# Altium project Drug Delivery CON_V113.PrjPcb
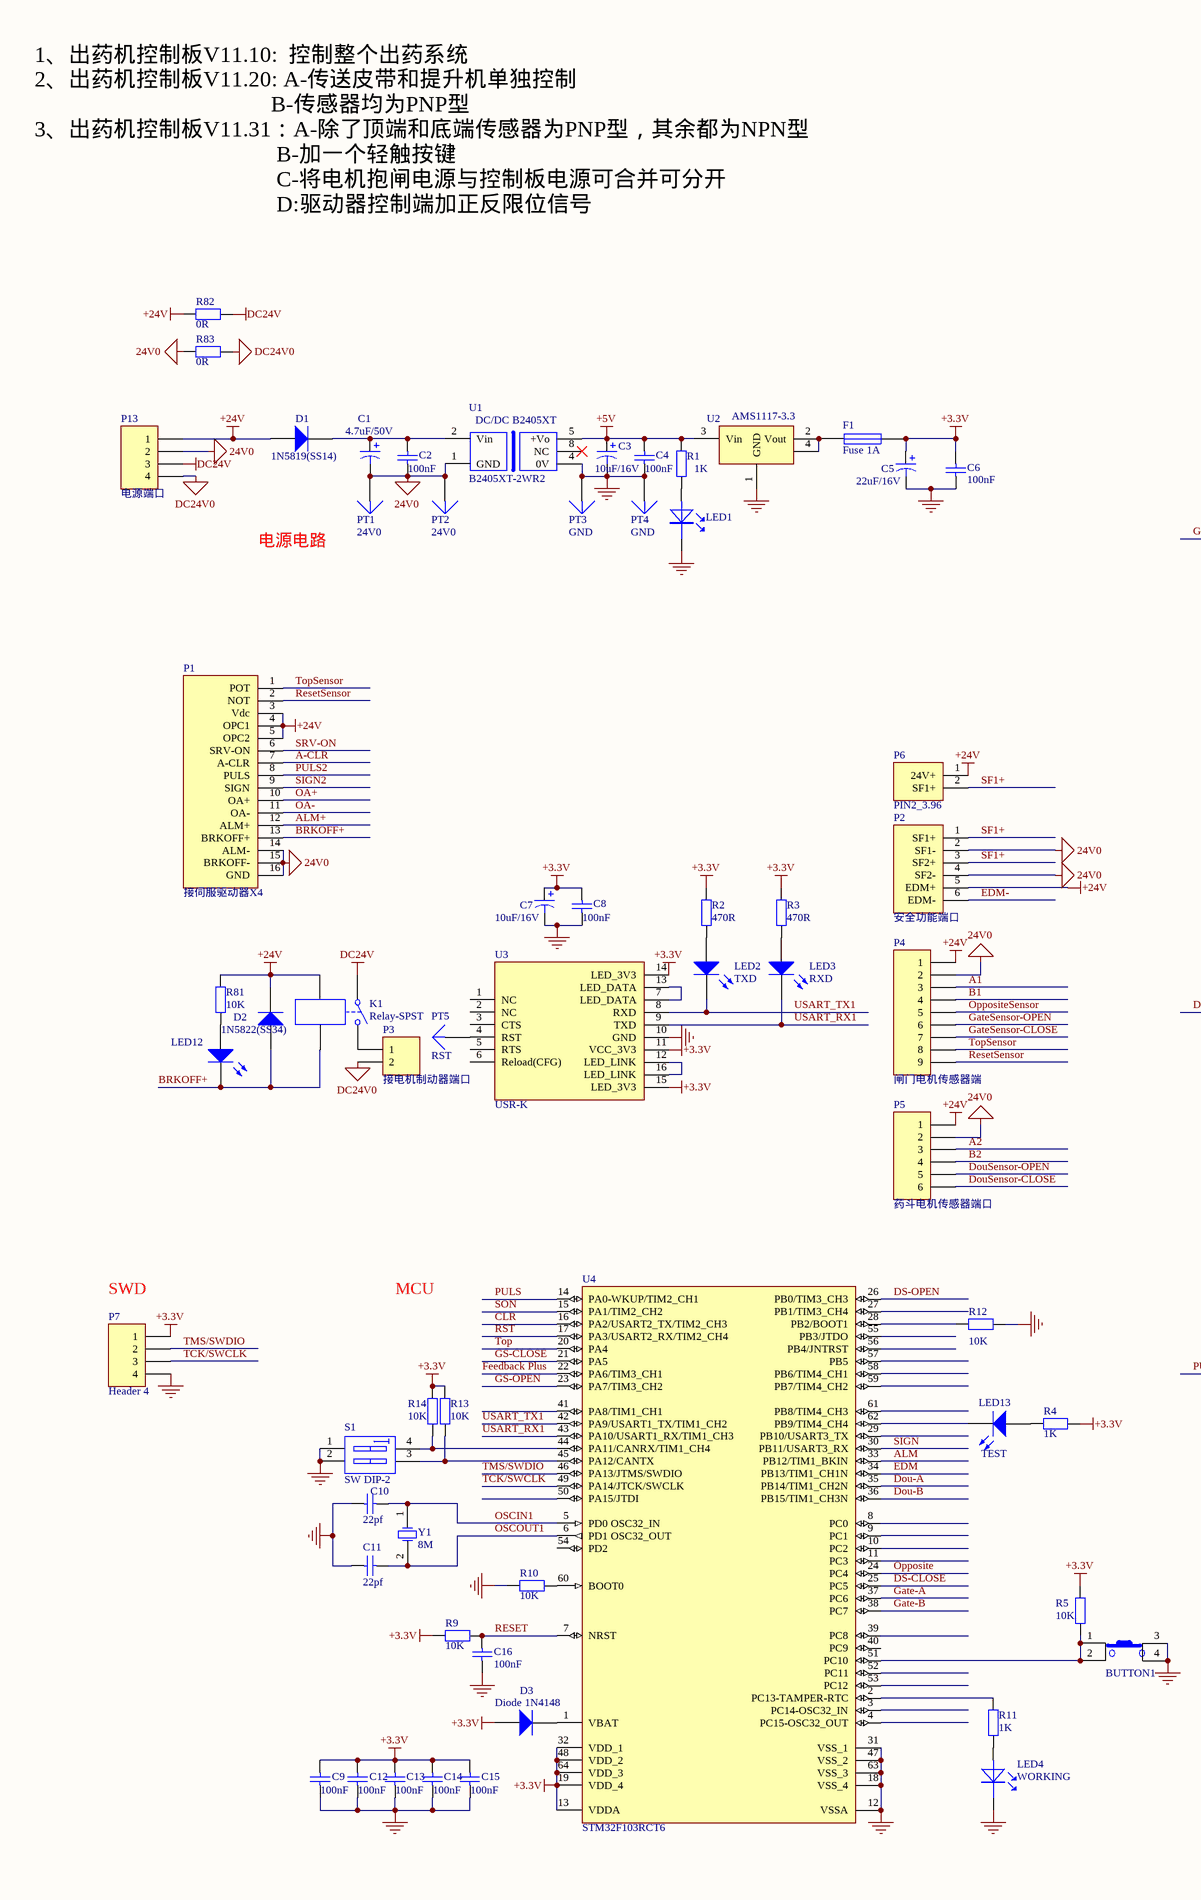
[diagram p0: Drug Delivery CON_V113.SchDoc, left]
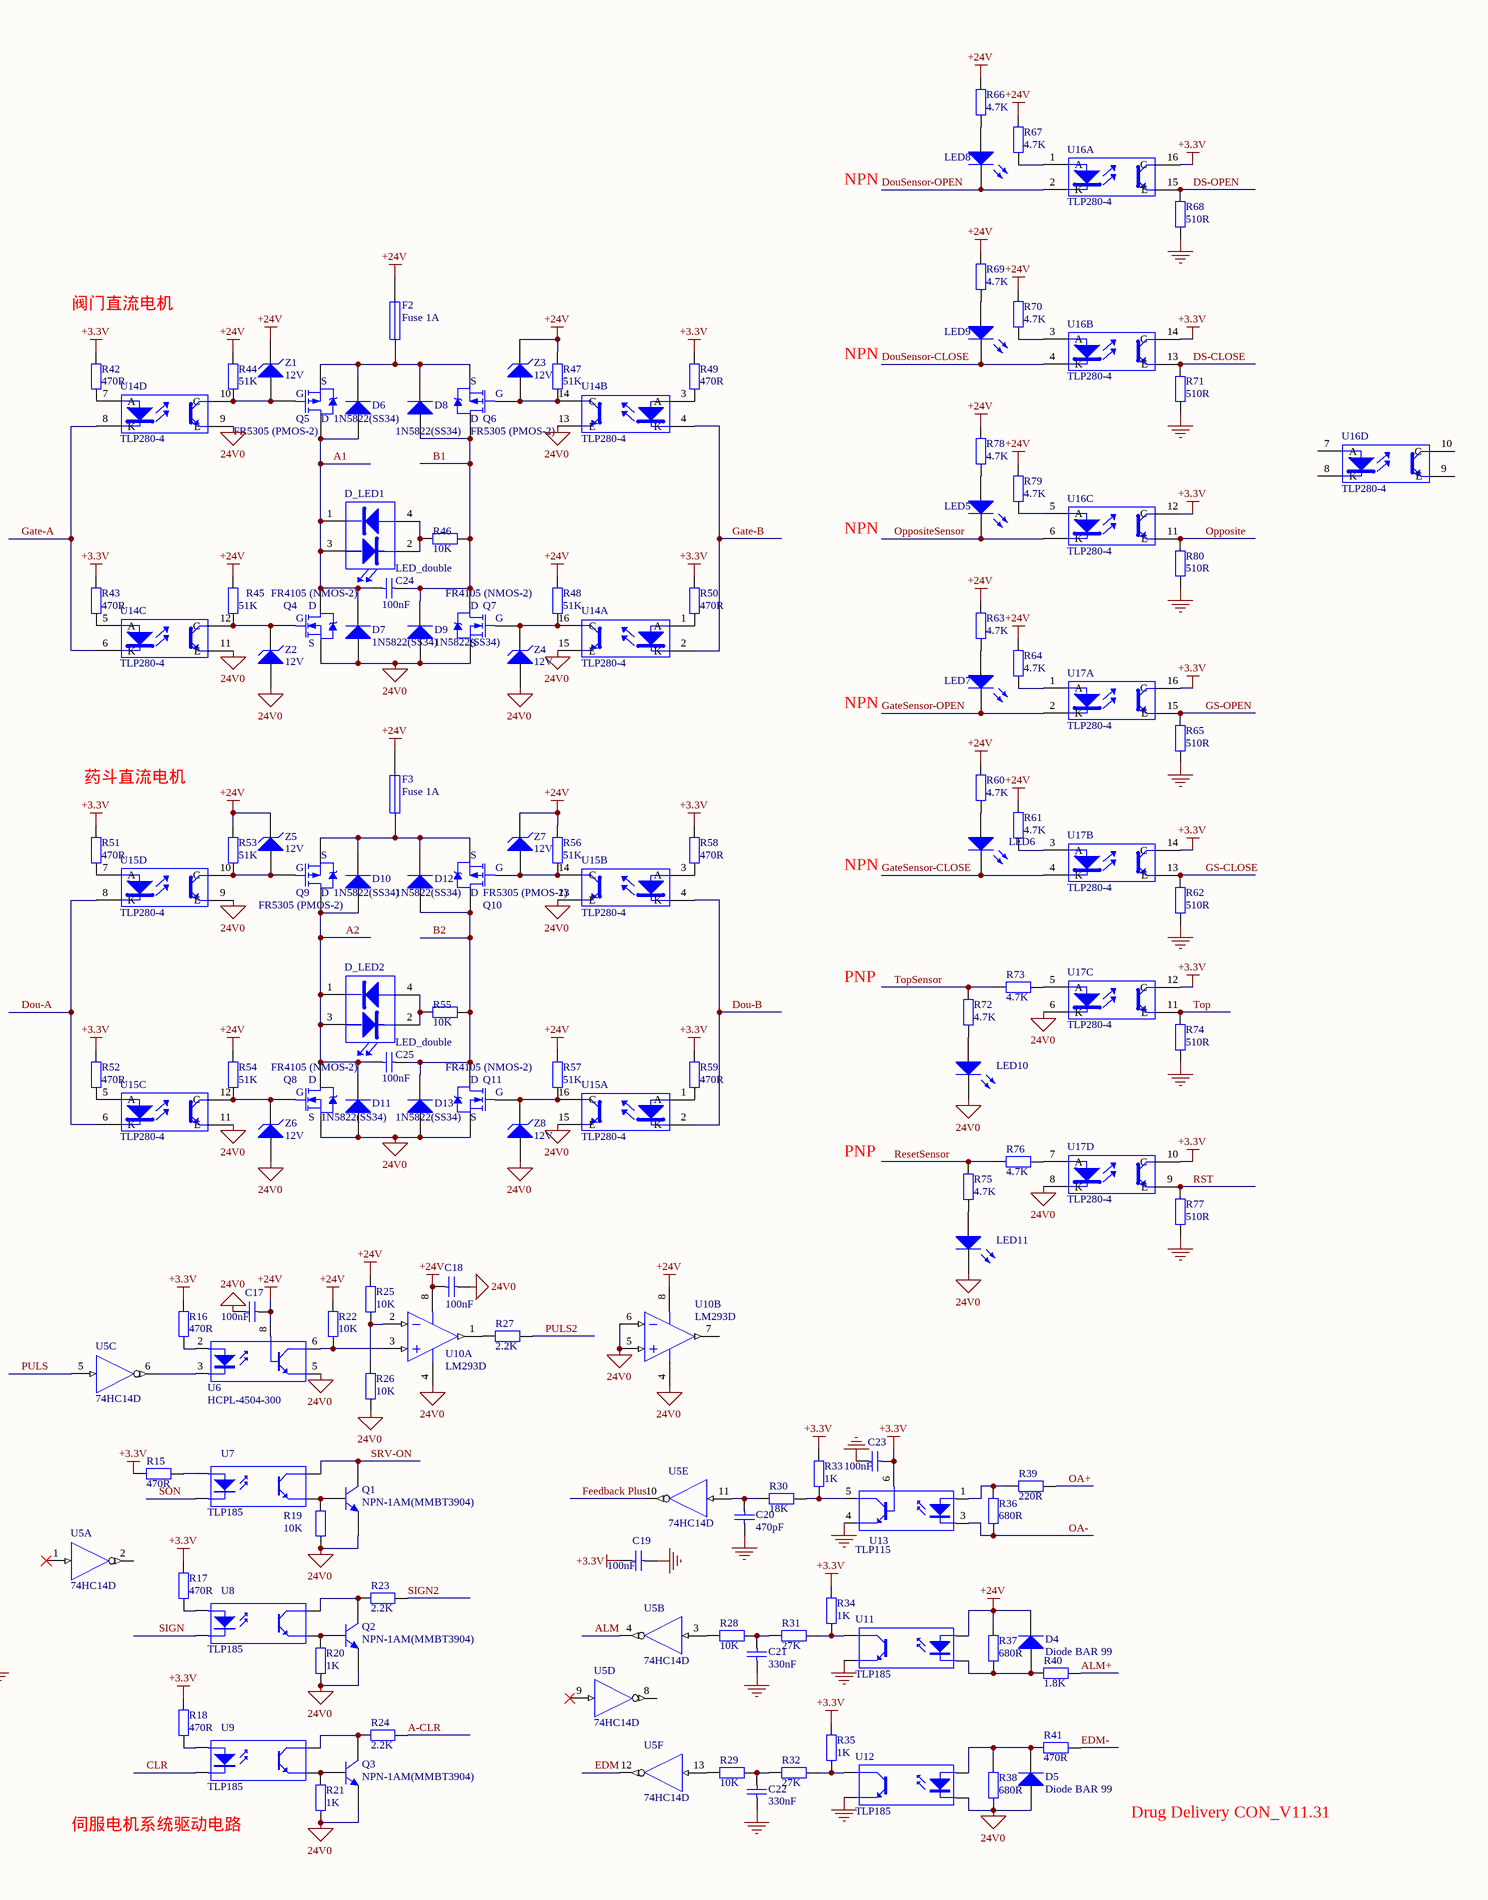
[diagram p1: Drug Delivery CON_V113.SchDoc, right]
1 sheet, 190 parts. Net scope: global (net labels, ports and power ports of the same name join across sheets).
Board file: Drug Delivery CON_V113.PcbDoc

## Sheet Drug Delivery CON_V113.SchDoc
size A2; PageSetup: Record=PageOptions|CenterHorizontal=True|CenterVertical=True|PrintScale=0.77|XCorrection=1.00|YCorrection=1.00|PrintKind=1|BorderSize=5000000|LeftOffset=0|BottomOffset=0|Orientation=2|PaperLength=1000|PaperWidth=1000|Scale=100|PaperSource=7|PrintQuality=-4|MediaType=1|DitherType=10|PaperKind=A3|PrintScaleMode=1

### Parts
(Parts that share a designator on the sheet are numbered #1, #2 ... from top to bottom, then left to right.)
BUTTON1  SW4  [BUTTON]  (value not drawn)
C1  value 4.7uF/50V  [CAP D-7343]  (hidden comment: Cap Pol3)
C2  value 100nF  [0805]  (hidden comment: Cap)
C3  value 10uF/16V  [CAP A-3216]  (hidden comment: Cap Pol3)
C4  value 100nF  [0805]  (hidden comment: Cap)
C5  value 22uF/16V  [CAP D-7343]  (hidden comment: Cap Pol3)
C6  value 100nF  [0805]  (hidden comment: Cap)
C7  value 10uF/16V  [CAP A-3216]  (hidden comment: Cap Pol3)
C8  value 100nF  [0805]  (hidden comment: Cap)
C9  value 100nF  [0805]  (hidden comment: Cap)
C10  value 22pf  [0805]
C11  value 22pf  [0805]
C12  value 100nF  [0805]  (hidden comment: Cap)
C13  value 100nF  [0805]  (hidden comment: Cap)
C14  value 100nF  [0805]  (hidden comment: Cap)
C15  value 100nF  [0805]  (hidden comment: Cap)
C16  value 100nF  [0805]  (hidden comment: Cap)
C17  value 100nF  [0805]  (hidden comment: Cap)
C18  value 100nF  [0805]  (hidden comment: Cap)
C19  value 100nF  [0805]  (hidden comment: Cap)
C20  value 470pF  [0805]  (hidden comment: Cap)
C21  value 330nF  [0805]  (hidden comment: Cap)
C22  value 330nF  [0805]  (hidden comment: Cap)
C23  value 100nF  [0805]  (hidden comment: Cap)
C24  value 100nF  [0805]  (hidden comment: Cap)
C25  value 100nF  [0805]  (hidden comment: Cap)
D1  1N5819(SS14)  [SMA]
D2  1N5822(SS34)  [SMA]
D3  Diode 1N4148  [LED-0805]
D4  Diode BAR 99  [SOT-23]
D5  Diode BAR 99  [SOT-23]
D6  1N5822(SS34)  [SMA]
D7  1N5822(SS34)  [SMA]
D8  1N5822(SS34)  [SMA]
D9  1N5822(SS34)  [SMA]
D10  1N5822(SS34)  [SMA]
D11  1N5822(SS34)  [SMA]
D12  1N5822(SS34)  [SMA]
D13  1N5822(SS34)  [SMA]
D_LED1  LED_double  [Double LED-0603]
D_LED2  LED_double  [Double LED-0603]
F1  Fuse 1A  [3225[1210]]
F2  Fuse 1A  [3225[1210]]
F3  Fuse 1A  [3225[1210]]
K1  Relay-SPST  [Delay_APA3312]
LED1  LED  [LED-0805]  (value not drawn)
LED2  TXD  [LED-0805]
LED3  RXD  [LED-0805]
LED4  WORKING  [LED-0805]
LED5  LED  [LED-0805]  (value not drawn)
LED6  LED  [LED-0805]  (value not drawn)
LED7  LED  [LED-0805]  (value not drawn)
LED8  LED  [LED-0805]  (value not drawn)
LED9  LED  [LED-0805]  (value not drawn)
LED10  LED  [LED-0805]  (value not drawn)
LED11  LED  [LED-0805]  (value not drawn)
LED12  LED  [LED-0805]  (value not drawn)
LED13  TEST  [LED-0805]
P1  接伺服驱动器X4  [VH3.96 16PIN]
P2  安全功能端口  [VH3.96  6PIN]
P3  接电机制动器端口  [VH3.96  2PIN]
P4  闸门电机传感器端  [VH3.96 9PIN]
P5  药斗电机传感器端口  [VH3.96  6PIN]
P6  PIN2_3.96  [VH3.96  2PIN]
P7  Header 4  [PIN4-1.27]
P13  电源端口  [VH3.96  4PIN]
PT1  24V0  [PLUG]
PT2  24V0  [PLUG]
PT3  GND  [PLUG]
PT4  GND  [PLUG]
PT5  RST  [PLUG]
Q1  NPN-1AM(MMBT3904)  [SOT-23B]
Q2  NPN-1AM(MMBT3904)  [SOT-23B]
Q3  NPN-1AM(MMBT3904)  [SOT-23B]
Q4  FR4105 (NMOS-2)  [TO-252]
Q5  FR5305 (PMOS-2)  [TO-252]
Q6  FR5305 (PMOS-2)  [TO-252]
Q7  FR4105 (NMOS-2)  [TO-252]
Q8  FR4105 (NMOS-2)  [TO-252]
Q9  FR5305 (PMOS-2)  [TO-252]
Q10  FR5305 (PMOS-2)  [TO-252]
Q11  FR4105 (NMOS-2)  [TO-252]
R1  value 1K  [0805]  (hidden comment: Res2)
R2  value 470R  [0805]  (hidden comment: Res2)
R3  value 470R  [0805]  (hidden comment: Res2)
R4  value 1K  [0805]  (hidden comment: Res2)
R5  value 10K  [0805]  (hidden comment: Res2)
R9  value 10K  [0805]  (hidden comment: Res2)
R10  value 10K  [0805]  (hidden comment: Res2)
R11  value 1K  [0805]  (hidden comment: Res2)
R12  value 10K  [0805]  (hidden comment: Res2)
R13  value 10K  [0805]  (hidden comment: Res2)
R14  value 10K  [0805]  (hidden comment: Res2)
R15  value 470R  [0805]  (hidden comment: Res2)
R16  value 470R  [0805]  (hidden comment: Res2)
R17  value 470R  [0805]  (hidden comment: Res2)
R18  value 470R  [0805]  (hidden comment: Res2)
R19  value 10K  [0805]  (hidden comment: Res2)
R20  value 1K  [0805]  (hidden comment: Res2)
R21  value 1K  [0805]  (hidden comment: Res2)
R22  value 10K  [0805]  (hidden comment: Res2)
R23  value 2.2K  [0805]  (hidden comment: Res2)
R24  value 2.2K  [0805]  (hidden comment: Res2)
R25  value 10K  [0805]  (hidden comment: Res2)
R26  value 10K  [0805]  (hidden comment: Res2)
R27  value 2.2K  [0805]  (hidden comment: Res2)
R28  value 10K  [0805]  (hidden comment: Res2)
R29  value 10K  [0805]  (hidden comment: Res2)
R30  value 18K  [0805]  (hidden comment: Res2)
R31  value 27K  [0805]  (hidden comment: Res2)
R32  value 27K  [0805]  (hidden comment: Res2)
R33  value 1K  [0805]  (hidden comment: Res2)
R34  value 1K  [0805]  (hidden comment: Res2)
R35  value 1K  [0805]  (hidden comment: Res2)
R36  value 680R  [0805]  (hidden comment: Res2)
R37  value 680R  [0805]  (hidden comment: Res2)
R38  value 680R  [0805]  (hidden comment: Res2)
R39  value 220R  [0805]  (hidden comment: Res2)
R40  value 1.8K  [0805]  (hidden comment: Res2)
R41  value 470R  [0805]  (hidden comment: Res2)
R42  value 470R  [0805]  (hidden comment: Res2)
R43  value 470R  [0805]  (hidden comment: Res2)
R44  value 51K  [0805]  (hidden comment: Res2)
R45  value 51K  [0805]  (hidden comment: Res2)
R46  value 10K  [0805]  (hidden comment: Res2)
R47  value 51K  [0805]  (hidden comment: Res2)
R48  value 51K  [0805]  (hidden comment: Res2)
R49  value 470R  [0805]  (hidden comment: Res2)
R50  value 470R  [0805]  (hidden comment: Res2)
R51  value 470R  [0805]  (hidden comment: Res2)
R52  value 470R  [0805]  (hidden comment: Res2)
R53  value 51K  [0805]  (hidden comment: Res2)
R54  value 51K  [0805]  (hidden comment: Res2)
R55  value 10K  [0805]  (hidden comment: Res2)
R56  value 51K  [0805]  (hidden comment: Res2)
R57  value 51K  [0805]  (hidden comment: Res2)
R58  value 470R  [0805]  (hidden comment: Res2)
R59  value 470R  [0805]  (hidden comment: Res2)
R60  value 4.7K  [0805]  (hidden comment: Res2)
R61  value 4.7K  [0805]  (hidden comment: Res2)
R62  value 510R  [0805]  (hidden comment: Res2)
R63  value 4.7K  [0805]  (hidden comment: Res2)
R64  value 4.7K  [0805]  (hidden comment: Res2)
R65  value 510R  [0805]  (hidden comment: Res2)
R66  value 4.7K  [0805]  (hidden comment: Res2)
R67  value 4.7K  [0805]  (hidden comment: Res2)
R68  value 510R  [0805]  (hidden comment: Res2)
R69  value 4.7K  [0805]  (hidden comment: Res2)
R70  value 4.7K  [0805]  (hidden comment: Res2)
R71  value 510R  [0805]  (hidden comment: Res2)
R72  value 4.7K  [0805]  (hidden comment: Res2)
R73  value 4.7K  [0805]  (hidden comment: Res2)
R74  value 510R  [0805]  (hidden comment: Res2)
R75  value 4.7K  [0805]  (hidden comment: Res2)
R76  value 4.7K  [0805]  (hidden comment: Res2)
R77  value 510R  [0805]  (hidden comment: Res2)
R78  value 4.7K  [0805]  (hidden comment: Res2)
R79  value 4.7K  [0805]  (hidden comment: Res2)
R80  value 510R  [0805]  (hidden comment: Res2)
R81  value 10K  [0805]  (hidden comment: Res2)
R82  value 0R  [0805]  (hidden comment: Res2)
R83  value 0R  [0805]  (hidden comment: Res2)
S1  SW DIP-2  [SW2  4DIP]
U1  B2405XT-2WR2  [B2405XT-2WR2]
U2  AMS1117-3.3  [SOT223]
U3  USR-K  [USR-K]
U4  STM32F103RCT6  [LQFP64_M]
U5#1  74HC14D  [SO14]  (parts A,B,C,D,E of 6)
U5#2  74HC14D  [SO14]  (part F of 6)
U6  HCPL-4504-300  [SO8(7.62)]
U7  TLP185  [SOP4]
U8  TLP185  [SOP4]
U9  TLP185  [SOP4]
U10  LM293D  [SOP8]  (parts A,B of 2)
U11  TLP185  [SOP4]
U12  TLP185  [SOP4]
U13  TLP115  [SOP5(6)]
U14  TLP280-4  [SOP16]  (parts A,B,C,D of 4)
U15  TLP280-4  [SOP16]  (parts A,B,C,D of 4)
U16  TLP280-4  [SOP16]  (parts A,B,C,D of 4)
U17  TLP280-4  [SOP16]  (parts A,B,C,D of 4)
Y1  8M  [XTAL]
Z1  12V  [SMA]
Z2  12V  [SMA]
Z3  12V  [SMA]
Z4  12V  [SMA]
Z5  12V  [SMA]
Z6  12V  [SMA]
Z7  12V  [SMA]
Z8  12V  [SMA]

### Nets
24V0: C1.2 C2.2 C17.2 C18.1 D5.3(A) D7.1(A) D9.1(A) D11.1(A) D13.1(A) LED10.2(K) LED11.2(K) P1.14(ALM-) P1.15(BRKOFF-) P1.16(GND) P2.2(SF1-) P2.4(SF2-) P4.2 P5.2 P13.2 PT1.1 PT2.1 Q1.2(E) Q2.2(E) Q3.2(E) Q4.3(S) Q7.3(S) Q8.3(S) Q11.3(S) R19.1 R20.2 R21.2 R26.1 R38.2 R83.1 U1.1(GND) U6.5(E) U10.4(GND) U10.5(IN+) U10.6(IN-) U12.2(K) U14.9(E) U14.11(E) U14.13(E) U14.15(E) U15.9(E) U15.11(E) U15.13(E) U15.15(E) U17.6(K) U17.8(K) Z2.1(A) Z4.1(A) Z6.1(A) Z8.1(A)
+3.3V: C5.1 C6.2 C7.1 C8.2 C9.2 C12.2 C13.2 C14.2 C15.2 C19.2 C23.1 D3.1(A) F1.2 P7.1 R2.2 R3.2 R4.1 R5.1 R9.1 R13.1 R14.1 R15.2 R16.1 R17.1 R18.1 R33.1 R34.1 R35.1 R42.1 R43.1 R49.2 R50.2 R51.1 R52.2 R58.1 R59.2 U3.11(VCC_3V3) U3.14(LED_3V3) U3.15(LED_3V3) U4.13(VDDA) U4.19(VDD_4) U4.32(VDD_1) U4.48(VDD_2) U4.64(VDD_3) U5#1.14(VCC) U5#2.14(VCC) U13.6(B) U16.12(C) U16.14(C) U16.16(C) U17.10(C) U17.12(C) U17.14(C) U17.16(C)
+5V: C3.1 C4.2 R1.1 U1.5(+Vo) U2.3(Vin)
+24V: C17.1 C18.2 D1.1(A) D2.2(K) D4.1(K) F2.2 F3.2 K1.1 P1.3(Vdc) P1.4(OPC1) P1.5(OPC2) P2.5(EDM+) P4.1 P5.1 P6.1(24V+) P13.1 R22.1 R25.2 R37.1 R44.2 R45.2 R47.2 R48.2 R53.2 R54.2 R56.2 R57.2 R60.1 R61.1 R63.1 R64.1 R66.1 R67.1 R69.1 R70.1 R78.2 R79.1 R81.1 R82.1 U6.7 U6.8(B) U10.8(V+) U11.1(A) Z1.2(K) Z3.2(K) Z5.2(K) Z7.2(K)
DC24V: K1.3 P13.3 R82.2
DC24V0: P3.2 P13.4 R83.2
GND: BUTTON1.3 BUTTON1.4 C3.2 C4.1 C5.2 C6.1 C7.2 C8.1 C9.1 C10.1 C11.1 C12.1 C13.1 C14.1 C15.1 C16.1 C19.1 C20.2 C21.2 C22.2 C23.2 LED1.2 LED4.2 P7.4 PT3.1 PT4.1 R10.1 R12.1 R62.1 R65.1 R68.1 R71.1 R74.1 R77.1 R80.1 S1.1(A1) S1.2(A2) U1.4(0V) U2.1(GND) U3.10(GND) U4.12(VSSA) U4.18(VSS_4) U4.31(VSS_1) U4.47(VSS_2) U4.63(VSS_3) U5#1.7(GND) U5#2.7(GND) U11.3(E) U12.3(E) U13.4(E)
A1: C24.2 D6.1(A) D7.2(K) D_LED1.1 D_LED1.3 P4.3 Q4.2(D) Q5.2(D)
A2: C25.2 D10.1(A) D11.2(K) D_LED2.1 D_LED2.3 P5.3 Q8.2(D) Q9.2(D)
A-CLR: P1.7(A-CLR) R24.2
ALM: U4.33(PB12/TIM1_BKIN) U5#1.4(Y)
ALM+: P1.12(ALM+) R40.2
B1: C24.1 D8.1(A) D9.2(K) P4.4 Q6.2(D) Q7.2(D) R46.1
B2: C25.1 D12.1(A) D13.2(K) P5.4 Q10.2(D) Q11.2(D) R55.1
BRKOFF+: D2.1(A) K1.2 LED12.2(K) P1.13(BRKOFF+)
CLR: U4.16(PA2/USART2_TX/TIM2_CH3) U9.2(K)
Dou-A: U4.35(PB14/TIM1_CH2N) U15.6(K) U15.8(K)
Dou-B: U4.36(PB15/TIM1_CH3N) U15.2(K) U15.4(K)
DouSensor-CLOSE: LED9.2(K) P5.6 U16.4(K)
DouSensor-OPEN: LED8.2(K) P5.5 U16.2(K)
DS-CLOSE: R71.2 U4.25(PC5) U16.13(E)
DS-OPEN: R68.2 U4.26(PB0/TIM3_CH3) U16.15(E)
EDM: U4.34(PB13/TIM1_CH1N) U5#2.12(Y)
EDM-: P2.6(EDM-) R41.2
Feedback Plus: U4.22(PA6/TIM3_CH1) U5#1.10(Y)
Gate-A: U4.37(PC6) U14.6(K) U14.8(K)
Gate-B: U4.38(PC7) U14.2(K) U14.4(K)
GateSensor-CLOSE: LED6.2(K) P4.7 U17.4(K)
GateSensor-OPEN: LED7.2(K) P4.6 U17.2(K)
GS-CLOSE: R62.2 U4.21(PA5) U17.13(E)
GS-OPEN: R65.2 U4.23(PA7/TIM3_CH2) U17.15(E)
OA+: P1.10(OA+) R39.2
OA-: P1.11(OA-) R36.2 U13.3(K)
Opposite: R80.2 U4.24(PC4) U16.11(E)
OppositeSensor: LED5.2(K) P4.5 U16.6(K)
OSCIN1: C10.2 U4.5(PD0_OSC32_IN) Y1.1(OSC1)
OSCOUT1: C11.2 U4.6(PD1_OSC32_OUT) Y1.2(OSC2)
PULS: U4.14(PA0-WKUP/TIM2_CH1) U5#1.5(A)
PULS2: P1.8(PULS) R27.2
RESET: C16.2 R9.2 U4.7(NRST)
ResetSensor: P1.2(NOT) P4.9 R75.1 R76.2
RST: R77.2 U4.17(PA3/USART2_RX/TIM2_CH4) U17.9(E)
SF1+: P2.1(SF1+) P2.3(SF2+) P6.2(SF1+)
SIGN: U4.30(PB11/USART3_RX) U8.2(K)
SIGN2: P1.9(SIGN) R23.2
SON: U4.15(PA1/TIM2_CH2) U7.2(K)
SRV-ON: P1.6(SRV-ON) Q1.3(C) U7.4(C)
TCK/SWCLK: P7.3 U4.49(PA14/JTCK/SWCLK)
TMS/SWDIO: P7.2 U4.46(PA13/JTMS/SWDIO)
Top: R74.2 U4.20(PA4) U17.11(E)
TopSensor: P1.1(POT) P4.8 R72.1 R73.2
USART_RX1: LED3.2(K) U3.9(TXD) U4.43(PA10/USART1_RX/TIM1_CH3)
USART_TX1: LED2.2(K) U3.8(RXD) U4.42(PA9/USART1_TX/TIM1_CH2)
NetBUTTON1_1: BUTTON1.1 BUTTON1.2 R5.2 U4.51(PC10)
NetC1_1: C1.1 C2.1 D1.2(K) U1.2(Vin)
NetC20_1: C20.1 R30.1 U5#1.11(A)
NetC21_1: C21.1 R28.2 R31.1
NetC22_1: C22.1 R29.2 R32.1
NetD3_2: D3.2(K) U4.1(VBAT)
NetD4_3: D4.3(A) R37.2 R40.1 U11.2(K)
NetD5_1: D5.1(K) R38.1 R41.1 U12.1(A)
NetD6_2: D6.2(K) D8.2(K) F2.1 Q5.3(S) Q6.3(S)
NetD10_2: D10.2(K) D12.2(K) F3.1 Q9.3(S) Q10.3(S)
NetD_LED1_2: D_LED1.2 D_LED1.4 R46.2
NetD_LED2_2: D_LED2.2 D_LED2.4 R55.2
NetF1_1: F1.1 U2.2(Vout) U2.4
NetK1_4: K1.4 P3.1
NetLED1_1: LED1.1 R1.2
NetLED2_1: LED2.1(A) R2.1
NetLED3_1: LED3.1(A) R3.1
NetLED4_1: LED4.1 R11.1
NetLED5_1: LED5.1(A) R78.1
NetLED6_1: LED6.1(A) R60.2
NetLED7_1: LED7.1(A) R63.2
NetLED8_1: LED8.1(A) R66.2
NetLED9_1: LED9.1(A) R69.2
NetLED10_1: LED10.1(A) R72.2
NetLED11_1: LED11.1(A) R75.2
NetLED12_1: LED12.1(A) R81.2
NetLED13_1: LED13.1(A) R4.2
NetLED13_2: LED13.2(K) U4.62(PB9/TIM4_CH4)
NetPT5_1: PT5.1 U3.4(RST)
NetQ1_1: Q1.1(B) R19.2 U7.3(E)
NetQ2_1: Q2.1(B) R20.1 U8.3(E)
NetQ2_3: Q2.3(C) R23.1 U8.4(C)
NetQ3_1: Q3.1(B) R21.1 U9.3(E)
NetQ3_3: Q3.3(C) R24.1 U9.4(C)
NetQ4_1: Q4.1(G) R45.1 U14.12(C) Z2.2(K)
NetQ5_1: Q5.1(G) R44.1 U14.10(C) Z1.1(A)
NetQ6_1: Q6.1(G) R47.1 U14.14(C) Z3.1(A)
NetQ7_1: Q7.1(G) R48.1 U14.16(C) Z4.2(K)
NetQ8_1: Q8.1(G) R54.1 U15.12(C) Z6.2(K)
NetQ9_1: Q9.1(G) R53.1 U15.10(C) Z5.1(A)
NetQ10_1: Q10.1(G) R56.1 U15.14(C) Z7.1(A)
NetQ11_1: Q11.1(G) R57.1 U15.16(C) Z8.2(K)
NetR10_2: R10.2 U4.60(BOOT0)
NetR11_2: R11.2 U4.2(PC13-TAMPER-RTC)
NetR12_2: R12.2 U4.28(PB2/BOOT1)
NetR13_2: R13.2 S1.3(B2) U4.45(PA12/CANTX)
NetR14_2: R14.2 S1.4(B1) U4.44(PA11/CANRX/TIM1_CH4)
NetR15_1: R15.1 U7.1(A)
NetR16_2: R16.2 U6.2(A)
NetR17_2: R17.2 U8.1(A)
NetR18_2: R18.2 U9.1(A)
NetR22_2: R22.2 U6.6(C) U10.3(IN+)
NetR25_1: R25.1 R26.2 U10.2(IN-)
NetR27_1: R27.1 U10.1(OUT)
NetR28_1: R28.1 U5#1.3(A)
NetR29_1: R29.1 U5#2.13(A)
NetR30_2: R30.2 R33.2 U13.5(C)
NetR31_2: R31.2 R34.2 U11.4(C)
NetR32_2: R32.2 R35.2 U12.4(C)
NetR36_1: R36.1 R39.1 U13.1(A)
NetR42_2: R42.2 U14.7(A)
NetR43_2: R43.2 U14.5(A)
NetR49_1: R49.1 U14.3(A)
NetR50_1: R50.1 U14.1(A)
NetR51_2: R51.2 U15.7(A)
NetR52_1: R52.1 U15.5(A)
NetR58_2: R58.2 U15.3(A)
NetR59_1: R59.1 U15.1(A)
NetR61_2: R61.2 U17.3(A)
NetR64_2: R64.2 U17.1(A)
NetR67_2: R67.2 U16.1(A)
NetR70_2: R70.2 U16.3(A)
NetR73_1: R73.1 U17.5(A)
NetR76_1: R76.1 U17.7(A)
NetR79_2: R79.2 U16.5(A)
NetU3_7: U3.7(LED_DATA) U3.13(LED_DATA)
NetU3_12: U3.12(LED_LINK) U3.16(LED_LINK)
NetU5#1_6: U5#1.6(Y) U6.3(K)

Not connected (* = marked no-connect by the designer): U1 8(NC)*; U3 1(NC) 2(NC) 3(CTS) 5(RTS) 6(Reload(CFG)); U4 3(PC14-OSC32_IN) 4(PC15-OSC32_OUT) 8(PC0) 9(PC1) 10(PC2) 11(PC3) 27(PB1/TIM3_CH4) 29(PB10/USART3_TX) 39(PC8) 40(PC9) 41(PA8/TIM1_CH1) 50(PA15/JTDI) 52(PC11) 53(PC12) 54(PD2) 55(PB3/JTDO) 56(PB4/JNTRST) 57(PB5) 58(PB6/TIM4_CH1) 59(PB7/TIM4_CH2) 61(PB8/TIM4_CH3); U5#1 1(A)* 2(Y) 8(Y) 9(A)*; U6 1(13) 4(13); U10 7(OUT); U16 7(A) 8(K) 9(E) 10(C)

### Notes on the sheet
- NPN
- 1、出药机控制板V11.10:  控制整个出药系统
  2、出药机控制板V11.20: A-传送皮带和提升机单独控制
  B-传感器均为PNP型
  3、出药机控制板V11.31：A-除了顶端和底端传感器为PNP型，其余都为NPN型
  B-加一个轻触按键
  C-将电机抱闸电源与控制板电源可合并可分开
  D:驱动器控制端加正反限位信号
- 阀门直流电机
- (near Q5) G
- (near Q5) S
- (near Q6) S
- (near Q6) G
- (near Q5) D
- (near Q6) D
- 电源电路
- (near Q4) G
- (near Q4) D
- (near Q4) S
- (near Q7) D
- (near Q7) S
- (near Q7) G
- 药斗直流电机
- (near Q9) G
- (near Q9) S
- (near Q9) D
- (near Q10) D
- (near Q10) S
- (near Q10) G
- PNP
- (near Q8) D
- (near Q11) D
- (near Q8) G
- (near Q8) S
- (near Q11) S
- (near Q11) G
- (near P7) SWD
- MCU
- 伺服电机系统驱动电路
- Drug Delivery CON_V11.31
- (in symbol B2405XT-2WR2) DC/DC B2405XT

### Library data of the parts
C1 C3 C5 C7 = Cap Pol3: Polarized Capacitor (Surface Mount); Published: 8-Jun-2000; LatestRevisionDate: 17-Jul-2002; LatestRevisionNote: Re-released for DXP Platform.; PackageReference: C0805; Publisher: Altium Limited
C2 C4 C6 C8-C25 = Cap: Capacitor; Published: 8-Jun-2000; LatestRevisionDate: 17-Jul-2002; LatestRevisionNote: Re-released for DXP Platform.; PackageReference: RAD-0.3; Publisher: Altium Limited
  C2 C9-C15 C17-C23: PackageDescription: Radial Cap, Thru-Hole; 2 Leads; 0.3 in Pin Spacing
D1-D3 D6-D13 = Diode 1N4148: High Conductance Fast Diode; Published: 8-Jun-2000; LatestRevisionDate: 17-Jul-2002; LatestRevisionNote: Re-released for DXP Platform.; DatasheetDocument: 1997; PackageReference: DO-35; Publisher: Altium Limited; Code_JEDEC: DO-204-AH; ComponentLink1Description: Manufacturer Link; ComponentLink1URL: http://www.fairchildsemi.com/; ComponentLink2Description: Datasheet; ComponentLink2URL: http://www.fairchildsemi.com/ds/1N%2F1N4148.pdf
D4 D5 = Diode BAS21: Silicon Switching Diode for High-Speed, High-Voltage Switching; Note: Pin 2 is not connected and not drawn.; Published: 21-Mar-2003; DatasheetDocument: Oct-1999; PackageDocument: Sep-2001; PackageReference: SOT-23; Publisher: Altium Limited; ComponentLink1Description: Manufacturer Link; ComponentLink1URL: http://www.infineon.com/; ComponentLink2Description: Datasheet; ComponentLink2URL: http://www.infineon.com/upload/Document/cmc_upload/documents/080/812/bas21series.pdf
F1-F3 = Fuse 1: Fuse; Published: 8-Jun-2000; LatestRevisionDate: 17-Jul-2002; LatestRevisionNote: Re-released for DXP Platform.; PackageReference: PIN-W2/E2.8; Publisher: Altium Limited
K1 = Relay-SPST: Single-Pole Single-Throw Relay; Published: 24-Mar-1999; LatestRevisionDate: 17-Jul-2002; LatestRevisionNote: Re-released for DXP Platform.; PackageReference: MODULE4; Publisher: Altium Limited
LED2 LED3 LED5-LED13 = LED2: Typical RED, GREEN, YELLOW, AMBER GaAs LED; Published: 8-Jun-2000; LatestRevisionDate: 17-Jul-2002; LatestRevisionNote: Re-released for DXP Platform.; PackageDocument: Feb-2002; PackageReference: 3.2X1.6X1.1; Publisher: Altium Limited
LED4 = LED
P1 = PIN16_3.96
P2 = PIN6_3.96
P3 = Header 2: Header, 2-Pin; LatestRevisionDate: 17-Jul-2002; LatestRevisionNote: Re-released for DXP Platform.; Publisher: Altium Limited
P4 = Header 9: Header, 9-Pin; LatestRevisionDate: 17-Jul-2002; LatestRevisionNote: Re-released for DXP Platform.; Publisher: Altium Limited
P5 = Header 6: Header, 6-Pin; LatestRevisionDate: 17-Jul-2002; LatestRevisionNote: Re-released for DXP Platform.; Publisher: Altium Limited
P7 P13 = Header 4: Header, 4-Pin; LatestRevisionDate: 17-Jul-2002; LatestRevisionNote: Re-released for DXP Platform.; Publisher: Altium Limited
PT1-PT5 = Plug: LatestRevisionDate: 17-Jul-2002; LatestRevisionNote: Re-released for DXP Platform.; Publisher: Altium Limited
Q1-Q3 = NPN: NPN Bipolar Transistor; Published: 8-Jun-2000; LatestRevisionDate: 17-Jul-2002; LatestRevisionNote: Re-released for DXP Platform.; PackageReference: TO-226; Publisher: Altium Limited; Code_JEDEC: TO-226-AA
Q4 Q7 Q8 Q11 = NMOS-2: N-Channel Power MOSFET; Note: Pin 2 is electrically connected to pin 4.; Published: 8-Jun-2000; LatestRevisionDate: 17-Jul-2002; LatestRevisionNote: Re-released for DXP Platform.; DatasheetDocument: PD-9.814; PackageReference: TO-220AB; Publisher: Altium Limited; Code_JEDEC: TO-220-AB; ComponentLink1Description: Manufacturer Link; ComponentLink1URL: http://www.irf.com/
Q5 Q6 Q9 Q10 = PMOS-2: P-Channel Power MOSFET; Note: Pin 4 not drawn and electrically connected to Pin 2.; Published: 8-Jun-2000; LatestRevisionDate: 17-Jul-2002; LatestRevisionNote: Re-released for DXP Platform.; DatasheetDocument: PD-9.390D; PackageReference: TO-220AB; Publisher: Altium Limited; Code_JEDEC: TO-220-AB; ComponentLink1Description: Manufacturer Link; ComponentLink1URL: http://www.irf.com/
R1-R5 R9-R83 = Res2: Resistor; Published: 8-Jun-2000; LatestRevisionDate: 17-Jul-2002; LatestRevisionNote: Re-released for DXP Platform.; PackageReference: AXIAL-0.4; Publisher: Altium Limited
  R1 R4 R5 R10-R41 R78 R82 R83: PackageDescription: Axial Device, Thru-Hole; 2 Leads; 0.4 in Pin Spacing
S1 = SW DIP-2: DIP Switch, 2 Position, SPST; Published: 24-Mar-1999; LatestRevisionDate: 17-Jul-2002; LatestRevisionNote: Re-released for DXP Platform.; PackageReference: DIP-4; Publisher: Altium Limited
U2 = AMS1117-5
U5#1 = SN74HC14D: Hex Schmitt-Trigger Inverter; Published: 8-Jun-2000; LatestRevisionDate: 13-Apr-2006; LatestRevisionNote: IPC-7351 Footprint Added.; DatasheetVersion: May-1997; PackageVersion: Jan-1998; PackageReference: D014; Publisher: Altium Limited; PackageDescription: 14-Pin Small Outline Integrated Circuit 1.27 mm Pitch; Code_IPC: SOIC127P600-14; ComponentLink1Description: Manufacturer Link; ComponentLink1URL: http://www.ti.com/; ComponentLink2Description: Datasheet; ComponentLink2URL: http://www-s.ti.com/sc/ds/sn74hc14.pdf
U5#2 = SN74LV14D: Hex Schmitt-Trigger Inverter; Published: 8-Jun-2000; LatestRevisionDate: 13-Apr-2006; LatestRevisionNote: IPC-7351 Footprint Added.; DatasheetVersion: Feb-1998; PackageVersion: Jan-1998; PackageReference: D014; Publisher: Altium Limited; PackageDescription: 14-Pin Small Outline Integrated Circuit 1.27 mm Pitch; Code_IPC: SOIC127P600-14; ComponentLink1Description: Manufacturer Link; ComponentLink1URL: http://www.ti.com/; ComponentLink2Description: Datasheet; ComponentLink2URL: http://www-s.ti.com/sc/ds/sn74lv14.pdf
U6 U13 = Optoisolator2: 5 Pin Mini Flat Pack Optocoupler; Published: 24-Mar-1999; LatestRevisionDate: 04-Mar-2005; LatestRevisionNote: PCB Footprint replaced, Sch pins re-numbered.; DatasheetDocument: Apr-2004; PackageReference: SOP5(6); Publisher: Altium Limited
U7-U9 U11 U12 = Optoisolator1: 4-Pin Phototransistor Optocoupler; Published: 24-Mar-1999; LatestRevisionDate: 04-Mar-2005; LatestRevisionNote: Sch pins 3 & 4 Swapped.; DatasheetDocument: Nov-2003; PackageReference: DIP-4; Publisher: Altium Limited
U10 = LM293D: Dual Comparator; Published: 17-Jul-2002; LatestRevisionDate: 13-Apr-2006; LatestRevisionNote: IPC-7351 Footprint Added.; DatasheetVersion: 1988; PackageReference: 751-02; Publisher: Altium Limited; PackageDescription: 8-Pin Small Outline Integrated Circuit 1.27 mm Pitch; Code_JEDEC: MS-012-AA; Code_IPC: SOIC127P600-8; ComponentLink1Description: Manufacturer Link; ComponentLink1URL: http://www.onsemi.com/site/products/taxonomy/0,4438,133,00.html
U14-U17 = TLP521-4
Y1 = XTAL_1
Z1-Z8 = D Zener: Zener Diode; Published: 8-Jun-2000; LatestRevisionDate: 17-Jul-2002; LatestRevisionNote: Re-released for DXP Platform.; PackageReference: DIODE-0.7; Publisher: Altium Limited